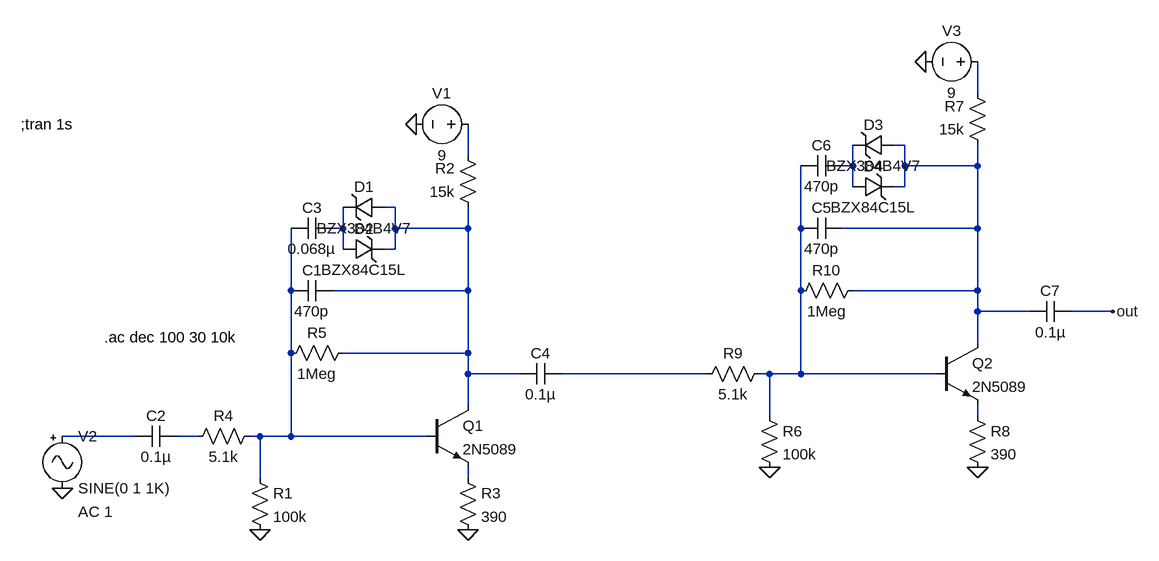
[diagram p0: schematic BM stage 2 and 3.asc]
BM stage 2 and 3.asc, the LTspice schematic file:
Version 4
SHEET 1 1464 680
WIRE 1200 -240 1200 -288
WIRE 1088 -160 1072 -160
WIRE 416 -144 416 -192
WIRE 1008 -128 1008 -160
WIRE 1008 -128 992 -128
WIRE 1088 -128 1088 -160
WIRE 1200 -128 1200 -160
WIRE 1200 -128 1088 -128
WIRE 1008 -96 1008 -128
WIRE 1088 -96 1088 -128
WIRE 1088 -96 1072 -96
WIRE 304 -64 288 -64
WIRE 224 -32 224 -64
WIRE 224 -32 208 -32
WIRE 304 -32 304 -64
WIRE 416 -32 416 -64
WIRE 416 -32 304 -32
WIRE 928 -32 928 -128
WIRE 1200 -32 1200 -128
WIRE 1200 -32 992 -32
WIRE 224 0 224 -32
WIRE 304 0 304 -32
WIRE 304 0 288 0
WIRE 144 64 144 -32
WIRE 416 64 416 -32
WIRE 416 64 208 64
WIRE 928 64 928 -32
WIRE 1200 64 1200 -32
WIRE 1200 64 1008 64
WIRE 1200 96 1200 64
WIRE 1280 96 1200 96
WIRE 1408 96 1344 96
WIRE 1200 144 1200 96
WIRE 144 160 144 64
WIRE 416 160 416 64
WIRE 416 160 224 160
WIRE 416 192 416 160
WIRE 496 192 416 192
WIRE 784 192 560 192
WIRE 880 192 864 192
WIRE 928 192 928 64
WIRE 928 192 880 192
WIRE 1136 192 928 192
WIRE 416 240 416 192
WIRE 880 256 880 192
WIRE 1200 256 1200 240
WIRE -96 288 -208 288
WIRE 0 288 -32 288
WIRE 96 288 80 288
WIRE 144 288 144 160
WIRE 144 288 96 288
WIRE 352 288 144 288
WIRE 96 352 96 288
WIRE 416 352 416 336
FLAG 416 432 0
FLAG -208 368 0
FLAG 336 -192 0
FLAG 96 432 0
FLAG 1200 336 0
FLAG 1120 -288 0
FLAG 880 336 0
FLAG 1408 96 out
SYMBOL voltage 432 -192 R90
WINDOW 0 -32 56 VBottom 2
WINDOW 3 32 56 VTop 2
WINDOW 123 0 0 Left 0
WINDOW 39 0 0 Left 0
SYMATTR InstName V1
SYMATTR Value 9
SYMBOL npn 352 240 R0
SYMATTR InstName Q1
SYMATTR Value 2N5089
SYMBOL Misc\\signal -208 272 R0
WINDOW 123 24 132 Left 2
WINDOW 39 0 0 Left 0
SYMATTR InstName V2
SYMATTR Value2 AC 1
SYMBOL res 80 336 R0
SYMATTR InstName R1
SYMATTR Value 100k
SYMBOL res 432 -48 R180
WINDOW 0 36 76 Left 2
WINDOW 3 36 40 Left 2
SYMATTR InstName R2
SYMATTR Value 15k
SYMBOL cap 208 48 R90
WINDOW 0 0 32 VBottom 2
WINDOW 3 32 32 VTop 2
SYMATTR InstName C1
SYMATTR Value 470p
SYMATTR SpiceLine V=6.3 Irms=12.2m Rser=6.97891 Lser=0 mfg="KEMET" pn="C0402C471K9RAC" type="X7R"
SYMBOL cap -32 272 R90
WINDOW 0 0 32 VBottom 2
WINDOW 3 32 32 VTop 2
SYMATTR InstName C2
SYMATTR Value 0.1µ
SYMATTR SpiceLine V=4 Irms=0 Rser=0 Lser=0 mfg="Murata" pn="GRM022R60G473KE15" type="X5R"
SYMBOL res 400 336 R0
SYMATTR InstName R3
SYMATTR Value 390
SYMBOL res 96 272 R90
WINDOW 0 0 56 VBottom 2
WINDOW 3 32 56 VTop 2
SYMATTR InstName R4
SYMATTR Value 5.1k
SYMBOL res 240 144 R90
WINDOW 0 0 56 VBottom 2
WINDOW 3 32 56 VTop 2
SYMATTR InstName R5
SYMATTR Value 1Meg
SYMBOL cap 208 -48 R90
WINDOW 0 0 32 VBottom 2
WINDOW 3 32 32 VTop 2
SYMATTR InstName C3
SYMATTR Value 0.068µ
SYMBOL zener 288 -80 R90
WINDOW 0 0 32 VBottom 2
WINDOW 3 32 32 VTop 2
SYMATTR InstName D1
SYMATTR Value BZX384B4V7
SYMATTR Description Diode
SYMATTR Type diode
SYMBOL zener 224 16 R270
WINDOW 0 32 32 VTop 2
WINDOW 3 0 32 VBottom 2
SYMATTR InstName D2
SYMATTR Value BZX84C15L
SYMATTR Description Diode
SYMATTR Type diode
SYMBOL cap 560 176 R90
WINDOW 0 0 32 VBottom 2
WINDOW 3 32 32 VTop 2
SYMATTR InstName C4
SYMATTR Value 0.1µ
SYMBOL voltage 1216 -288 R90
WINDOW 0 -32 56 VBottom 2
WINDOW 3 32 56 VTop 2
WINDOW 123 0 0 Left 0
WINDOW 39 0 0 Left 0
SYMATTR InstName V3
SYMATTR Value 9
SYMBOL npn 1136 144 R0
SYMATTR InstName Q2
SYMATTR Value 2N5089
SYMBOL res 864 240 R0
SYMATTR InstName R6
SYMATTR Value 100k
SYMBOL res 1216 -144 R180
WINDOW 0 36 76 Left 2
WINDOW 3 36 40 Left 2
SYMATTR InstName R7
SYMATTR Value 15k
SYMBOL cap 992 -48 R90
WINDOW 0 0 32 VBottom 2
WINDOW 3 32 32 VTop 2
SYMATTR InstName C5
SYMATTR Value 470p
SYMATTR SpiceLine V=6.3 Irms=12.2m Rser=6.97891 Lser=0
SYMBOL res 1184 240 R0
SYMATTR InstName R8
SYMATTR Value 390
SYMBOL res 880 176 R90
WINDOW 0 0 56 VBottom 2
WINDOW 3 32 56 VTop 2
SYMATTR InstName R9
SYMATTR Value 5.1k
SYMBOL res 1024 48 R90
WINDOW 0 0 56 VBottom 2
WINDOW 3 32 56 VTop 2
SYMATTR InstName R10
SYMATTR Value 1Meg
SYMBOL cap 992 -144 R90
WINDOW 0 0 32 VBottom 2
WINDOW 3 32 32 VTop 2
SYMATTR InstName C6
SYMATTR Value 470p
SYMBOL zener 1072 -176 R90
WINDOW 0 0 32 VBottom 2
WINDOW 3 32 32 VTop 2
SYMATTR InstName D3
SYMATTR Value BZX384B4V7
SYMATTR Description Diode
SYMATTR Type diode
SYMBOL zener 1008 -80 R270
WINDOW 0 32 32 VTop 2
WINDOW 3 0 32 VBottom 2
SYMATTR InstName D4
SYMATTR Value BZX84C15L
SYMATTR Description Diode
SYMATTR Type diode
SYMBOL cap 1344 80 R90
WINDOW 0 0 32 VBottom 2
WINDOW 3 32 32 VTop 2
SYMATTR InstName C7
SYMATTR Value 0.1µ
TEXT -272 -192 Left 2 !;tran 1s
TEXT -144 136 Left 2 !.ac dec 100 30 10k

The netlist it stands for:
* BM stage 2 and 3.asc
V1 N003 0 9
Q1 N005 N008 N013 0 2N5089
V2 N011 0 SINE(0 1 1K) AC 1
R1 N008 0 100k
R2 N005 N003 15k
C1 N005 N008 470p V=6.3 Irms=12.2m Rser=6.97891 Lser=0 mfg="KEMET" pn="C0402C471K9RAC" type="X7R"
C2 N012 N011 0.1µ V=4 Irms=0 Rser=0 Lser=0 mfg="Murata" pn="GRM022R60G473KE15" type="X5R"
R3 N013 0 390
R4 N008 N012 5.1k
R5 N005 N008 1Meg
C3 N006 N008 0.068µ
D1 N005 N006 BZX384B4V7
D2 N006 N005 BZX84C15L
C4 N009 N005 0.1µ
V3 N001 0 9
Q2 N002 N007 N010 0 2N5089
R6 N007 0 100k
R7 N002 N001 15k
C5 N002 N007 470p V=6.3 Irms=12.2m Rser=6.97891 Lser=0
R8 N010 0 390
R9 N007 N009 5.1k
R10 N002 N007 1Meg
C6 N004 N007 470p
D3 N002 N004 BZX384B4V7
D4 N004 N002 BZX84C15L
C7 out N002 0.1µ
.model D D
.lib standard.dio
.model NPN NPN
.model PNP PNP
.lib standard.bjt
;tran 1s
.ac dec 100 30 10k
.backanno
.end